# EAGLE design Fascia_physioBoardV0 (EAGLE 9.5.2)
REV: 1
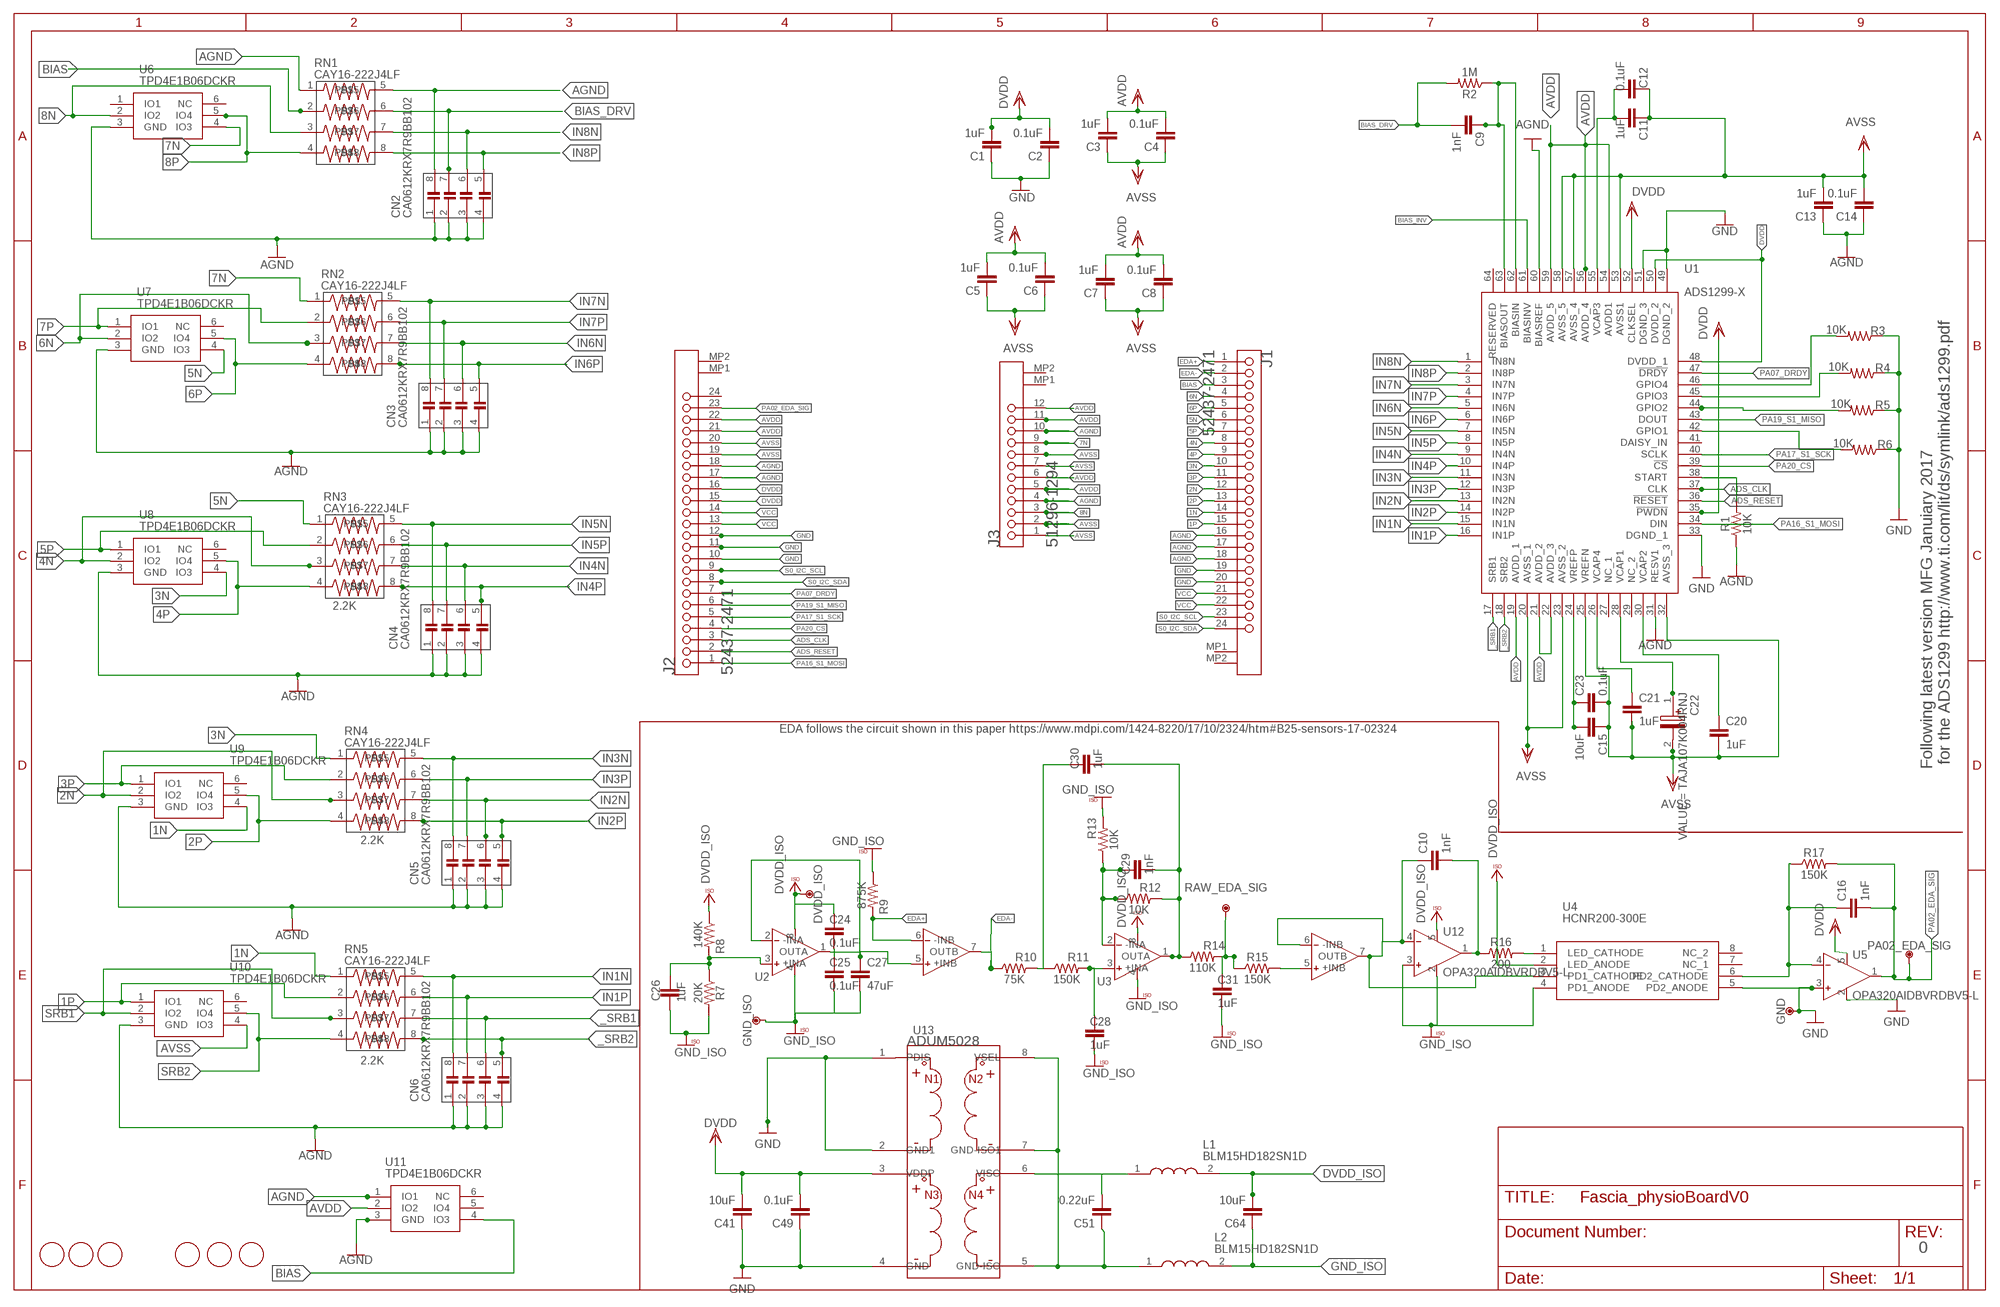
[diagram p0: schematic, sheet 1]
FRAME3 (FRAME_B_L): REV: 0

## Parts
C1  1uF  1UF-0402T-16V-10%  [0402-TIGHT]
C2  0.1uF  0.1UF-0402T-16V-10%  [0402-TIGHT]
C3  1uF  1UF-0402T-16V-10%  [0402-TIGHT]
C4  0.1uF  0.1UF-0402T-16V-10%  [0402-TIGHT]
C5  1uF  1UF-0402T-16V-10%  [0402-TIGHT]
C6  0.1uF  0.1UF-0402T-16V-10%  [0402-TIGHT]
C7  1uF  1UF-0402T-16V-10%  [0402-TIGHT]
C8  0.1uF  0.1UF-0402T-16V-10%  [0402-TIGHT]
C9  1nF  1NF-0402T-16V-10%  [0402-TIGHT]
C10  1nF  1NF-0402T-16V-10%  [0402-TIGHT]
C11  1uF  1UF-0402T-16V-10%  [0402-TIGHT]
C12  0.1uF  0.1UF-0402T-16V-10%  [0402-TIGHT]
C13  1uF  1UF-0402T-16V-10%  [0402-TIGHT]
C14  0.1uF  0.1UF-0402T-16V-10%  [0402-TIGHT]
C15  10uF  0.1UF-0402-16V-10%  [0402]
C16  1nF  1NF-0402T-16V-10%  [0402-TIGHT]
C20  1uF  1UF-0402T-16V-10%  [0402-TIGHT]
C21  1uF  1UF-0402T-16V-10%  [0402-TIGHT]
C22  TAJA107K004RNJ  [CAPPM3216X180N]
C23  0.1uF  0.1UF-0402T-16V-10%  [0402-TIGHT]
C24  0.1uF  0.1UF-0402T-16V-10%  [0402-TIGHT]
C25  0.1uF  0.1UF-0402T-16V-10%  [0402-TIGHT]
C26  1uF  1UF-0402T-16V-10%  [0402-TIGHT]
C27  47uF  47UF-0603-25V-5%  [0603]
C28  1uF  1UF-0402T-16V-10%  [0402-TIGHT]
C29  1nF  1NF-0402T-16V-10%  [0402-TIGHT]
C30  1uF  1UF-0402T-16V-10%  [0402-TIGHT]
C31  1uF  1UF-0402T-16V-10%  [0402-TIGHT]
C41  10uF  10UF-0603-6.3V-20%  [0603]
C49  0.1uF  0.1UF-0402T-16V-10%  [0402-TIGHT]
C51  0.22uF  0.22UF-0402T-16V-10%  [0402-TIGHT]
C64  10uF  10UF-0603-6.3V-20%  [0603]
CN2  CA0612KRX7R9BB102  [CA0612KRX7R9BB102]
CN3  CA0612KRX7R9BB102  [CA0612KRX7R9BB102]
CN4  CA0612KRX7R9BB102  [CA0612KRX7R9BB102]
CN5  CA0612KRX7R9BB102  [CA0612KRX7R9BB102]
CN6  CA0612KRX7R9BB102  [CA0612KRX7R9BB102]
DVDD_ISO  DNP  TPTP-0.8MM  [TP-0.8MM]
FD1  DNP  FIDUCIAL-1.5MM  [FD-1-1.5]
FD2  DNP  FIDUCIAL-1.5MM  [FD-1-1.5]
FD3  DNP  FIDUCIAL-1.5MM  [FD-1-1.5]
FD4  DNP  FIDUCIAL-1.5MM  [FD-1-1.5]
FD5  DNP  FIDUCIAL-1.5MM  [FD-1-1.5]
FD6  DNP  FIDUCIAL-1.5MM  [FD-1-1.5]
GND  DNP  TPTP-0.8MM  [TP-0.8MM]
GND_ISO  DNP  TPTP-0.8MM  [TP-0.8MM]
J1  MOLEX_52437-2471MOLEX_52437-2471_0_0  [MOLEX_52437-2471_0]
J2  MOLEX_52437-2471MOLEX_52437-2471_0_0  [MOLEX_52437-2471_0]
J3  MOLEX_51296-1294MOLEX_51296-1294_0_0  [MOLEX_51296-1294_0]
L1  BLM15HD182SN1D  [INDC1005X55N]
L2  BLM15HD182SN1D  [INDC1005X55N]
PA02_EDA_SIG  DNP  TPTP-0.8MM  [TP-0.8MM]
R1  10K  [0402-TIGHT]
R2  1M  [0402-TIGHT]
R3  10K  [0402-TIGHT]
R4  10K  [0402-TIGHT]
R5  10K  [0402-TIGHT]
R6  10K  [0402-TIGHT]
R7  20K  [0402-TIGHT]
R8  140K  [0402-TIGHT]
R9  875K  [0402-TIGHT]
R10  75K  [0402-TIGHT]
R11  150K  [0402-TIGHT]
R12  10K  [0402-TIGHT]
R13  10K  [0402-TIGHT]
R14  110K  [0402-TIGHT]
R15  150K  [0402-TIGHT]
R16  200  [0402-TIGHT]
R17  150K  [0402-TIGHT]
RAW_EDA_SIG  DNP  TPTP-0.8MM  [TP-0.8MM]
RN1  CAY16-222J4LF  [CAY16-222J4LF]
RN2  CAY16-222J4LF  [CAY16-222J4LF]
RN3  CAY16-222J4LF  [CAY16-222J4LF]
RN4  CAY16-222J4LF  [CAY16-222J4LF]
RN5  CAY16-222J4LF  [CAY16-222J4LF]
U1  ADS1299-X  [QFP50P1200X1200X120-64N]
U2  OPA2320AIDGKT_NOVA8-SOIC-L  [D8-L]
U3  OPA2320AIDGKT_NOVAL8-SOIC-L  [D8-L]
U4  HCNR200-300E  [SOP254P1230X400-8N]
U5  OPA320AIDBVRDBV5-L  [DBV5-L]
U6  TPD4E1B06DCKR  [SOT65P210X110-6N]
U7  TPD4E1B06DCKR  [SOT65P210X110-6N]
U8  TPD4E1B06DCKR  [SOT65P210X110-6N]
U9  TPD4E1B06DCKR  [SOT65P210X110-6N]
U10  TPD4E1B06DCKR  [SOT65P210X110-6N]
U11  TPD4E1B06DCKR  [SOT65P210X110-6N]
U12  OPA320AIDBVRDBV5-L  [DBV5-L]
U13  ADUM5028  [SOIC_IC]

## Nets
1N: J1.14 RN5.1 U9.4(IO3)
1P: J1.15 RN5.2 U10.1(IO1)
2N: J1.12 RN4.3 U9.2(IO2)
2P: J1.13 RN4.4 U9.5(IO4)
3N: J1.10 RN4.1 U8.4(IO3)
3P: J1.11 RN4.2 U9.1(IO1)
4N: J1.8 RN3.3 U8.2(IO2)
4P: J1.9 RN3.4 U8.5(IO4)
5N: J1.6 RN3.1 U7.4(IO3)
5P: J1.7 RN3.2 U8.1(IO1)
6N: J1.4 RN2.3 U7.2(IO2)
6P: J1.5 RN2.4 U7.5(IO4)
7N: J3.9 RN2.1 U6.4(IO3)
7P: RN2.2 U7.1(IO1)
8N: J3.3 RN1.3 U6.2(IO2)
8P: RN1.4 U6.5(IO4)
_SRB1: CN6.6(C15) RN5.7 U1.17(SRB1)
_SRB2: CN6.5(C14) RN5.8 U1.18(SRB2)
ADS_CLK: J2.3 U1.37(CLK)
ADS_RESET: J2.2 U1.36(!RESET)
AGND: C13.1 C14.1 CN2.1(C10) CN2.2(C11) CN2.3(C12) CN2.4(C13) CN2.8(C17) CN3.1(C10) CN3.2(C11) CN3.3(C12) CN3.4(C13) CN4.1(C10) CN4.2(C11) CN4.3(C12) CN4.4(C13) CN5.1(C10) CN5.2(C11) CN5.3(C12) CN5.4(C13) CN6.1(C10) CN6.2(C11) CN6.3(C12) CN6.4(C13) J1.16 J1.17 J1.18 J2.17 J2.18 J3.4 J3.10 R1.1 RN1.1 RN1.5 U1.31(RESV1) U1.60(BIASREF) U6.3(GND) U7.3(GND) U8.3(GND) U9.3(GND) U10.3(GND) U11.1(IO1) U11.3(GND)
AVDD: C3.2 C4.2 C5.2 C6.2 C7.2 C8.2 J2.21 J2.22 J3.5 J3.6 J3.11 J3.12 U1.19(AVDD_1) U1.21(AVDD_2) U1.22(AVDD_3) U1.54(AVDD1) U1.56(AVDD_4) U1.59(AVDD_5) U11.2(IO2)
AVSS: C3.1 C4.1 C5.1 C6.1 C7.1 C8.1 C11.1 C12.1 C13.2 C14.2 C15.1 C20.2 C21.2 C22.2(-) C23.2 J2.19 J2.20 J3.1 J3.2 J3.7 J3.8 U1.20(AVSS_1) U1.23(AVSS_2) U1.25(VREFN) U1.32(AVSS_3) U1.53(AVSS1) U1.57(AVSS_4) U1.58(AVSS_5) U10.4(IO3)
BIAS: J1.3 RN1.2 U11.4(IO3)
BIAS_DRV: C9.2 CN2.7(C16) R2.2 RN1.6
BIAS_INV: U1.61(BIASINV)
DVDD: C1.2 C2.2 C41.2 C49.2 J2.15 J2.16 U1.35(!PWDN) U1.48(DVDD_1) U1.50(DVDD_2) U1.52(CLKSEL) U5.5(V+) U13.3(VDDP)
DVDD_ISO: C24.1 C64.2 DVDD_ISO.X L1.2 R8.1 U2.8(V+) U3.8(V+) U4.2(LED_ANODE) U12.5(V+)
EDA+: J1.1 R9.2 U2.6(-INB)
EDA-: J1.2 R10.1 U2.7(OUTB)
GND: C1.1 C2.1 C41.1 C49.1 GND.X J1.19 J1.20 J2.10 J2.11 J2.12 R3.1 R4.1 R5.1 R6.1 U1.33(DGND_1) U1.49(DGND_2) U1.51(DGND_3) U4.5(PD2_ANODE) U5.2(V-) U5.3(IN+) U13.1(PDIS) U13.2(GND1) U13.4(GND)
GND_ISO: C25.2 C26.2 C27.2 C28.2 C31.2 C51.1 C64.1 GND_ISO.X L2.1 L2.2 R7.2 R9.1 R13.2 U2.4(V-) U3.4(V-) U4.4(PD1_ANODE) U12.2(V-) U12.3(IN+) U13.5(GND-ISO) U13.7(GND-ISO1) U13.8(VSEL)
IN1N: CN6.8(C17) RN5.5 U1.15(IN1N)
IN1P: CN6.7(C16) RN5.6 U1.16(IN1P)
IN2N: CN5.6(C15) RN4.7 U1.13(IN2N)
IN2P: CN5.5(C14) RN4.8 U1.14(IN2P)
IN3N: CN5.8(C17) RN4.5 U1.11(IN3N)
IN3P: CN5.7(C16) RN4.6 U1.12(IN3P)
IN4N: CN4.6(C15) RN3.7 U1.9(IN4N)
IN4P: CN4.5(C14) RN3.8 U1.10(IN4P)
IN5N: CN4.8(C17) RN3.5 U1.7(IN5N)
IN5P: CN4.7(C16) RN3.6 U1.8(IN5P)
IN6N: CN3.6(C15) RN2.7 U1.5(IN6N)
IN6P: CN3.5(C14) RN2.8 U1.6(IN6P)
IN7N: CN3.8(C17) RN2.5 U1.3(IN7N)
IN7P: CN3.7(C16) RN2.6 U1.4(IN7P)
IN8N: CN2.6(C15) RN1.7 U1.1(IN8N)
IN8P: CN2.5(C14) RN1.8 U1.2(IN8P)
N$1: C30.1 R10.2 R11.1
N$2: C26.1 R7.1 R8.2 U2.3(+INA)
N$3: C28.1 R11.2 U3.3(+INA)
N$4: C31.1 R14.2 R15.1 RAW_EDA_SIG.X
N$5: C10.2 R16.1 U12.1(OUT)
N$6: C51.2 L1.1 U13.6(VISO)
N$7: R16.2 U4.1(LED_CATHODE)
N$9: C16.1 R17.1 U4.6(PD2_CATHODE) U5.4(IN-)
N$10: C29.1 R12.1 R13.1 U3.2(-INA)
N$11: C29.2 C30.2 R12.2 R14.1 U3.1(OUTA)
N$12: C24.2 C25.1 C27.1 U2.2(-INA) U2.5(+INB)
N$14: R15.2 U3.5(+INB)
N$15: C10.1 U3.6(-INB) U3.7(OUTB) U4.3(PD1_CATHODE) U12.4(IN-)
N$17: C9.1 R2.1 U1.62(BIASIN) U1.63(BIASOUT)
N$22: C15.2 C23.1 U1.24(VREFP)
N$24: R3.2 U1.46(GPIO4)
N$48: R4.2 U1.45(GPIO3)
N$50: R5.2 U1.44(GPIO2)
N$52: R6.2 U1.42(GPIO1)
N$59: C21.1 U1.26(VCAP4)
N$60: C22.1(+) U1.28(VCAP1)
N$61: C20.1 U1.30(VCAP2)
N$63: C11.2 C12.2 U1.55(VCAP3)
N$66: R1.2 U1.38(START)
PA02_EDA_SIG: C16.2 J2.23 PA02_EDA_SIG.X R17.2 U5.1(OUT)
PA07_DRDY: J2.7 U1.47(!DRDY)
PA16_S1_MOSI: J2.1 U1.34(DIN)
PA17_S1_SCK: J2.5 U1.40(SCLK)
PA19_S1_MISO: J2.6 U1.43(DOUT)
PA20_CS: J2.4 U1.39(!CS)
S0_I2C_SCL: J1.23 J2.9
S0_I2C_SDA: J1.24 J2.8
SRB1: RN5.3 U10.2(IO2)
SRB2: RN5.4 U10.5(IO4)
VCC: J1.21 J1.22 J2.13 J2.14
Unconnected: J1.MP1 J1.MP2 J2.24 J2.MP1 J2.MP2 J3.MP1 J3.MP2 U1.27(NC_1) U1.29(NC_2) U1.41(DAISY_IN) U1.64(RESERVED) U2.1(OUTA) U4.7(NC_1) U4.8(NC_2) U6.1(IO1) U6.6(NC) U7.6(NC) U8.6(NC) U9.6(NC) U10.6(NC) U11.5(IO4) U11.6(NC)

## Notes on the sheet
- 2.2K
- EDA follows the circuit shown in this paper https://www.mdpi.com/1424-8220/17/10/2324/htm#B25-sensors-17-02324
- Following latest version MFG Januiary 2017
   for the ADS1299 http://www.ti.com/lit/ds/symlink/ads1299.pdf
- 2.2K
- ADUM5028
- 2.2K

## Library data of the parts
C1 C3 C5 C7 C11 C13 C20 C21 C26 C28 C30 C31 = novaXR:1UF: 1µF ceramic capacitors A capacitor is a passive two-terminal electrical component used to store electrical energy temporarily in an electric field.; PROD_ID: CAP-12416
C2 C4 C6 C8 C12 C14 C23-C25 C49 = novaXR:0.1UF: 0.1µF ceramic capacitors A capacitor is a passive two-terminal electrical component used to store electrical energy temporarily in an electric field.; PROD_ID: CAP-12416
C9 C10 C16 C29 = novaXR:1NF: 1nF ceramic capacitors A capacitor is a passive two-terminal electrical component used to store electrical energy temporarily in an electric field.; PROD_ID: CAP-12416
C15 = SparkFun-Capacitors:0.1UF: 0.1µF ceramic capacitors A capacitor is a passive two-terminal electrical component used to store electrical energy temporarily in an electric field.; PROD_ID: CAP-12416; VALUE: 0.1uF
C22 = SamacSys_Parts:TAJA107K004RNJ: AVX 100uF 4 V dc Tantalum Capacitor Electrolytic Solid +/-10% Tolerance TAJ Series Source: Datasheet; DESCRIPTION: AVX 100uF 4 V dc Tantalum Capacitor Electrolytic Solid +/-10% Tolerance TAJ Series; HEIGHT: 1.8mm; MANUFACTURER_NAME: AVX; MANUFACTURER_PART_NUMBER: TAJA107K004RNJ; MOUSER_PART_NUMBER: 581-TAJA107K004RNJ; MOUSER_PRICE-STOCK: https://www.mouser.com/Search/Refine.aspx?Keyword=581-TAJA107K004RNJ; RS_PART_NUMBER: 1360130; RS_PRICE-STOCK: http://uk.rs-online.com/web/p/products/1360130
C27 = novaXR:47UF: 47µF ceramic capacitors A capacitor is a passive two-terminal electrical component used to store electrical energy temporarily in an electric field.; PROD_ID: CAP-08604
C41 C64 = SparkFun-Capacitors:10UF: 10.0µF ceramic capacitors A capacitor is a passive two-terminal electrical component used to store electrical energy temporarily in an electric field.; PROD_ID: CAP-11015
C51 = novaXR:0.22UF: 0,22uF ceramic capacitors A capacitor is a passive two-terminal electrical component used to store electrical energy temporarily in an electric field.; PROD_ID: CAP-12416
CN2-CN6 = SamacSys_Parts:CA0612KRX7R9BB102: Capacitor,ceramic,multilayer,SMT,50V,1000pF Source: Datasheet; DESCRIPTION: Capacitor,ceramic,multilayer,SMT,50V,1pF; HEIGHT: mm; MANUFACTURER_NAME: YAGEO (PHYCOMP); MANUFACTURER_PART_NUMBER: CA0612KRX7R9BB102; MOUSER_PART_NUMBER: 603-CA612KRX7R9BB102; MOUSER_PRICE-STOCK: https://www.mouser.com/Search/Refine.aspx?Keyword=603-CA612KRX7R9BB102; RS_PART_NUMBER: 6169789; RS_PRICE-STOCK: http://uk.rs-online.com/web/p/products/6169789
DVDD_ISO GND GND_ISO PA02_EDA_SIG RAW_EDA_SIG = Arduino-utility:TP: Testpoint; CODE-ARDUINO: DNP; DATASHEET: DNP; DISTRIBUTOR-LINK: DNP; DISTRIBUTOR-PN: DNP; MANUFACTURER: DNP; MANUFACTURER-PN: DNP
FD1-FD6 = Arduino-utility:FIDUCIAL: Fiducial mount; CODE-ARDUINO: DNP; DATASHEET: DNP; DISTRIBUTOR-LINK: DNP; DISTRIBUTOR-PN: DNP; MANUFACTURER: DNP; MANUFACTURER-PN: DNP
J1 J2 = Molex - 52437-2471:MOLEX_52437-2471: MOLX-52437-2471; CIIVA_IDS: 605212; CIRCUITS_LOADED: 24; COMPONENT_LINK_1_DESCRIPTION: Manufacturer URL; COMPONENT_LINK_1_URL: http://www.molex.com/molex/index.jsp; COMPONENT_LINK_3_DESCRIPTION: Package Specification; COMPONENT_LINK_3_URL: http://www.molex.com/pdm_docs/sd/524372471_sd.pdf; CONTACT_POSITION: Bottom; CURRENT_MAX_PER_CONTACT: 0.5A; DATASHEET: http://www.molex.com/webdocs/datasheets/pdf/en-us/0524372471_FFC_FPC_CONNECTORS.pdf; DURABILITY_MATING_CYCLES_MAX: 20; ENTRY_ANGLE: 90degrees Angle; FOOTPRINT_VARIANT_NAME_0: Manufacturer Recommended; IMPORTED: yes; IMPORTED_FROM: vault; IMPORT_TS: 1521869192; MATERIAL___METAL: Phosphor Bronze; MATERIAL___PLATING_MATING: Gold; MATERIAL___PLATING_TERMINATION: Gold; MF: Molex; MOUNTING_TECHNOLOGY: Surface Mount; MPN: 52437-2471; NUMBER_OF_ROWS: 1; ORIENTATION: Right Angle; PACKAGE: 52437-2471; PACKAGE_DESCRIPTION: 24-Lead FPC Connector, Pitch 0.5 mm; PACKAGE_VERSION: Rev. E, 07/2013; PACKING: Tape and Reel; PCB_LOCATOR: No; PCB_RETENTION: None; PITCH___MATING_INTERFACE: 0.50mm; POLARIZED_TO_PCB: Yes; PREFIX: J; RELEASE_DATE: 1411372502; ROHS: Yes; STACKABLE: No; VAULT_GUID: C435F480-C5D6-47A9-8B3E-1F527B5FE02A; VAULT_REVISION: D1E34D73-9D44-46B4-956C-D39459EFC8BE; VOLTAGE_MAX: 50V
J3 = Molex - 51296-1294:MOLEX_51296-1294: MOLX-51296-1294; CIIVA_IDS: 3408585; CIRCUITS_LOADED: 12; COMPONENT_LINK_1_DESCRIPTION: Manufacturer URL; COMPONENT_LINK_1_URL: http://www.molex.com/molex/index.jsp; COMPONENT_LINK_3_DESCRIPTION: Package Specification; COMPONENT_LINK_3_URL: http://www.molex.com/pdm_docs/sd/512961294_sd.pdf; CONTACT_POSITION: Bottom; CURRENT_MAX_PER_CONTACT: 0.5A; DATASHEET: http://www.molex.com/webdocs/datasheets/pdf/en-us/0512961294_FFC_FPC_CONNECTORS.pdf; DURABILITY_MATING_CYCLES_MAX: 20; ENTRY_ANGLE: 90degrees Angle; FOOTPRINT_VARIANT_NAME_0: Manufacturer Recommended; IMPORTED: yes; IMPORTED_FROM: vault; IMPORT_TS: 1521848761; MATED_HEIGHT: 1.30mm; MATERIAL___METAL: Phosphor Bronze; MATERIAL___PLATING_MATING: Gold; MATERIAL___PLATING_TERMINATION: Gold; MF: Molex; MOUNTING_TECHNOLOGY: Surface Mount; MPN: 51296-1294; NUMBER_OF_ROWS: 1; ORIENTATION: Right Angle; PACKAGE: 51296-1294; PACKAGE_DESCRIPTION: 12-Lead FPC Connector, Pitch 0.5 mm; PACKAGE_VERSION: Rev. G, 02/2011; PACKING: Tape and Reel; PCB_LOCATOR: No; PCB_RETENTION: Yes; PITCH___MATING_INTERFACE: 0.50mm; POLARIZED_TO_PCB: Yes; PREFIX: J; RELEASE_DATE: 1411372363; ROHS: Yes; STACKABLE: No; VAULT_GUID: 5BB98A37-1DFE-42F8-ACC0-A2F2CBD76221; VAULT_REVISION: D4EEA741-95BA-4F80-9A9C-18942DF65E75; VOLTAGE_MAX: 50V AC (RMS)/DC
L1 L2 = SamacSys_Parts:BLM15HD182SN1D: Ferrite bead SMD 0402 1K8 200mA Ferrite bead SMD 0402 1K8 200mA Source: Datasheet; DESCRIPTION: Ferrite bead SMD 0402 1K8 200mA Ferrite bead SMD 0402 1K8 200mA; HEIGHT: 0.55mm; MANUFACTURER_NAME: Murata Electronics; MANUFACTURER_PART_NUMBER: BLM15HD182SN1D; MOUSER_PART_NUMBER: 81-BLM15HD182SN1D; MOUSER_PRICE-STOCK: https://www.mouser.com/Search/Refine.aspx?Keyword=81-BLM15HD182SN1D; RS_PART_NUMBER: 7926224P; RS_PRICE-STOCK: http://uk.rs-online.com/web/p/products/7926224P
R1 R3-R6 R12 R13 = novaXR:10K: 10KΩ resistor A resistor is a passive two-terminal electrical component that implements electrical resistance as a circuit element. Resistors act to reduce current flow, and, at the same time, act to lower voltage levels within circuits. - Wikipedia
R2 = novaXR:1M: 1MΩ resistor A resistor is a passive two-terminal electrical component that implements electrical resistance as a circuit element. Resistors act to reduce current flow, and, at the same time, act to lower voltage levels within circuits. - Wikipedia
R7 = novaXR:20K: 20KΩ resistor A resistor is a passive two-terminal electrical component that implements electrical resistance as a circuit element. Resistors act to reduce current flow, and, at the same time, act to lower voltage levels within circuits. - Wikipedia
R8 = novaXR:140K: 140KΩ resistor A resistor is a passive two-terminal electrical component that implements electrical resistance as a circuit element. Resistors act to reduce current flow, and, at the same time, act to lower voltage levels within circuits. - Wikipedia
R9 = novaXR:875K: 875KΩ resistor A resistor is a passive two-terminal electrical component that implements electrical resistance as a circuit element. Resistors act to reduce current flow, and, at the same time, act to lower voltage levels within circuits. - Wikipedia
R10 = novaXR:75K: 75KΩ resistor A resistor is a passive two-terminal electrical component that implements electrical resistance as a circuit element. Resistors act to reduce current flow, and, at the same time, act to lower voltage levels within circuits. - Wikipedia
R11 R15 R17 = novaXR:150K: 150KΩ resistor A resistor is a passive two-terminal electrical component that implements electrical resistance as a circuit element. Resistors act to reduce current flow, and, at the same time, act to lower voltage levels within circuits. - Wikipedia
R14 = novaXR:110K: 110KΩ resistor A resistor is a passive two-terminal electrical component that implements electrical resistance as a circuit element. Resistors act to reduce current flow, and, at the same time, act to lower voltage levels within circuits. - Wikipedia
R16 = novaXR:200: 200Ω resistor A resistor is a passive two-terminal electrical component that implements electrical resistance as a circuit element. Resistors act to reduce current flow, and, at the same time, act to lower voltage levels within circuits. - Wikipedia
RN1-RN5 = SamacSys_Parts:CAY16-222J4LF: 2.2k Ohm ±5% 62.5mW Power Per Element Isolated 4 Resistor Network/Array ±200ppm/°C 1206 (3216 Metric), Convex, Long Side Terminals Source: Datasheet; DESCRIPTION: RES ARRAY 4 RES 2.2K OHM 1206; DIGIKEY_NUMBER: CAY16-222J4LFCT-ND; HEIGHT: 0mm; MANUFACTURER_NAME: Bourns Inc; MANUFACTURER_PART_NUMBER: CAY16-222J4LF
U1 = SamacSys_Parts:ADS1299-X: ADS1299-x 24-Bit Analog-to-Digital Converters (ADCs) Source: Datasheet; DESCRIPTION: ADS1299-x 24-Bit Analog-to-Digital Converters (ADCs); HEIGHT: 1.2mm; MANUFACTURER_NAME: Texas Instruments; MANUFACTURER_PART_NUMBER: ADS1299-X
U2 = novaXR:OPA2320AIDGKT_NOVA: OPA2320AIDGKT, Dual Operational Amplifier Precision, 20MHz R-R, 1.8 to 5.5V, 8-Pin MSOP Source: Datasheet
U3 = novaXR:OPA2320AIDGKT_NOVAL: OPA2320AIDGKT, Dual Operational Amplifier Precision, 20MHz R-R, 1.8 to 5.5V, 8-Pin MSOP Source: Datasheet
U4 = HCNR200-300E:HCNR200-300E: Optocoupler AC/DC i/p DC o/p PDIP8 W SMD Avago HCNR200-300E DC Input Photodiode Output Optocoupler, Surface Mount, 8-Pin PDIP-W Source: Datasheet; DESCRIPTION: Optocoupler AC/DC i/p DC o/p PDIP8 W SMD Avago HCNR200-300E DC Input Photodiode Output Optocoupler, Surface Mount, 8-Pin PDIP-W; HEIGHT: 4mm; MANUFACTURER_NAME: Avago Technologies; MANUFACTURER_PART_NUMBER: HCNR200-300E; MOUSER_PART_NUMBER: 630-HCNR200-300E; MOUSER_PRICE-STOCK: https://www.mouser.com/Search/Refine.aspx?Keyword=630-HCNR200-300E; RS_PART_NUMBER: 6935264P; RS_PRICE-STOCK: http://uk.rs-online.com/web/p/products/6935264P
U5 U12 = novaXR:OPA320AIDBVR; MANUFACTURER_PART_NUMBER: OPA320AIDBVR; VENDOR: Texas Instruments
U6-U11 = SamacSys_Parts:TPD4E1B06DCKR: Texas Instruments TPD4E1B06DCKR Quad Bi-Directional ESD Protection Array, 45W peak, 6-Pin SC-70 Source: Datasheet; DESCRIPTION: Texas Instruments TPD4E1B06DCKR Quad Bi-Directional ESD Protection Array, 45W peak, 6-Pin SC-70; HEIGHT: 1.1mm; MANUFACTURER_NAME: Texas Instruments; MANUFACTURER_PART_NUMBER: TPD4E1B06DCKR; MOUSER_PART_NUMBER: 595-TPD4E1B06DCKR; MOUSER_PRICE-STOCK: https://www.mouser.com/Search/Refine.aspx?Keyword=595-TPD4E1B06DCKR; RS_PART_NUMBER: 8255330P; RS_PRICE-STOCK: http://uk.rs-online.com/web/p/products/8255330P
U13 = novaXR:ADUM5028: The ADuM5020 and ADuM50281 are isoPower®, integrated, isolated dc-to-dc converters. Based on the Analog Devices, Inc., iCoupler® technology, these dc-to-dc converters provide regulated, isolated power that is below CISPR22 Class B limits at full load on a 2-layer printed circuit board (PCB) with ferrites

## Net classes
0 default: width 0.19 mm, drill 0.19 mm

## Board
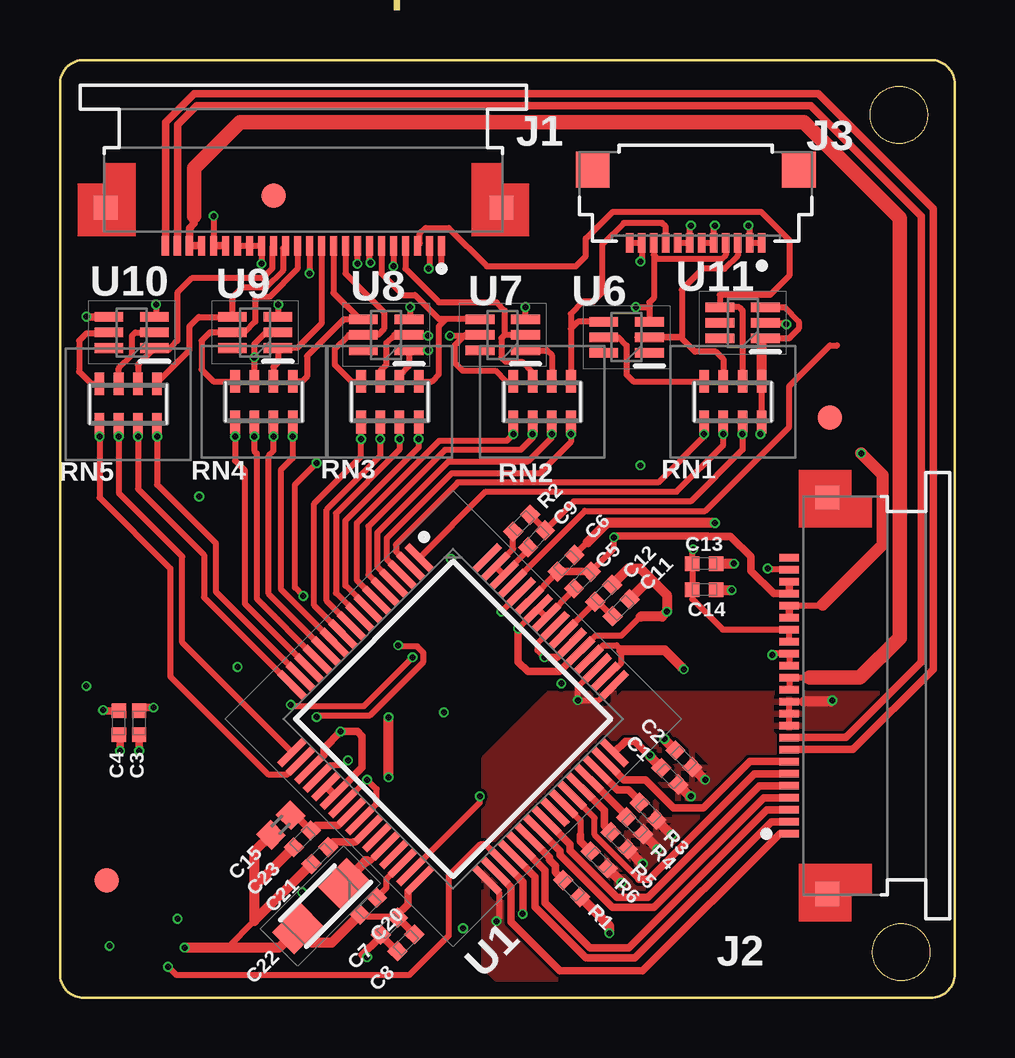
[diagram p1: board, top side]
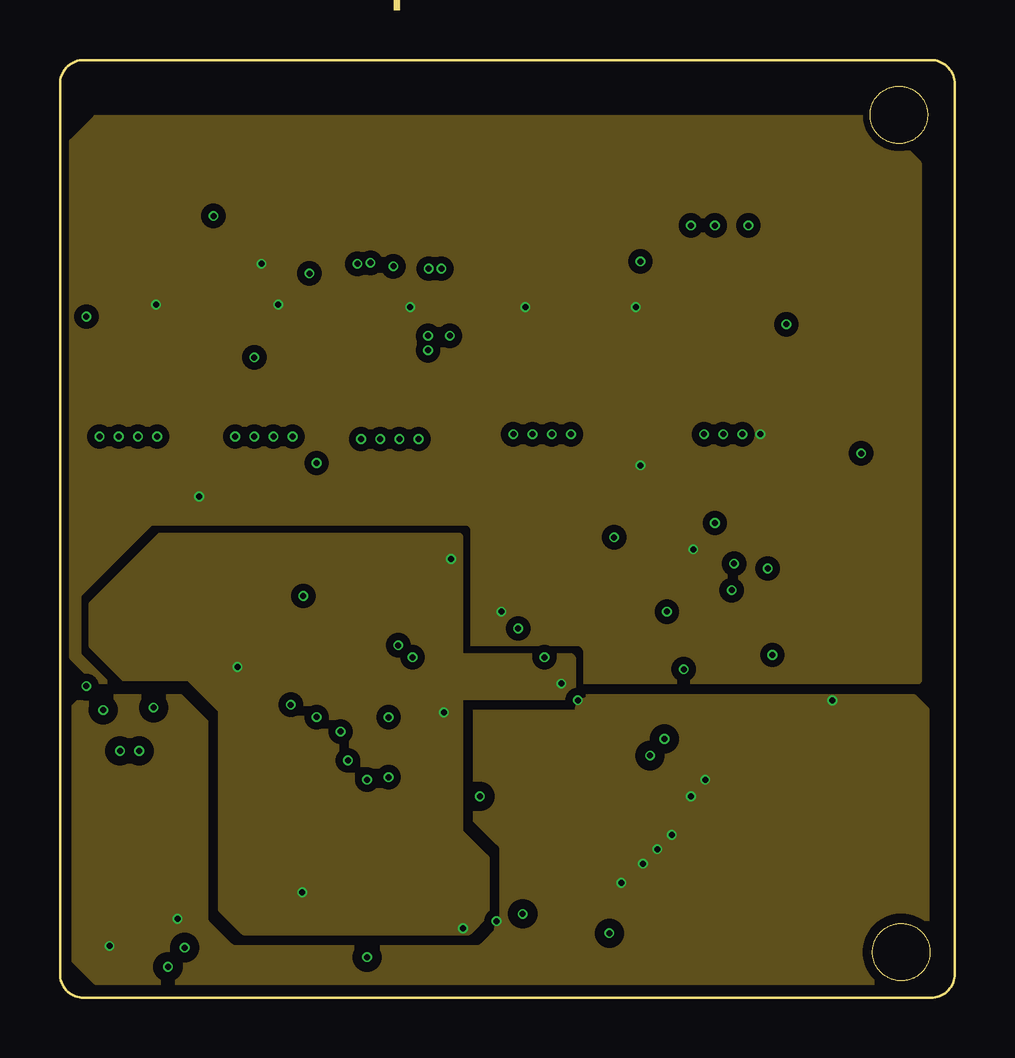
[diagram p2: board, inner layer Route2]
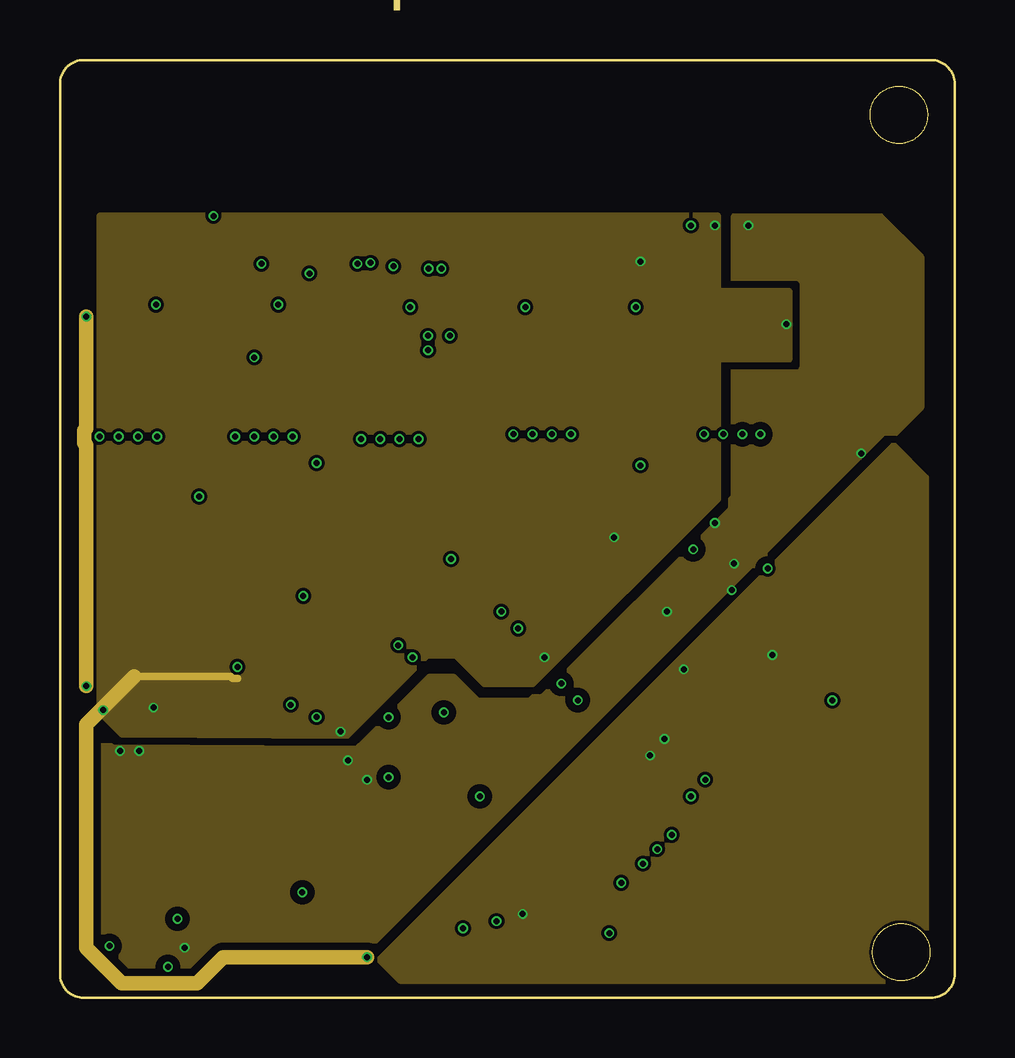
[diagram p3: board, inner layer Route15]
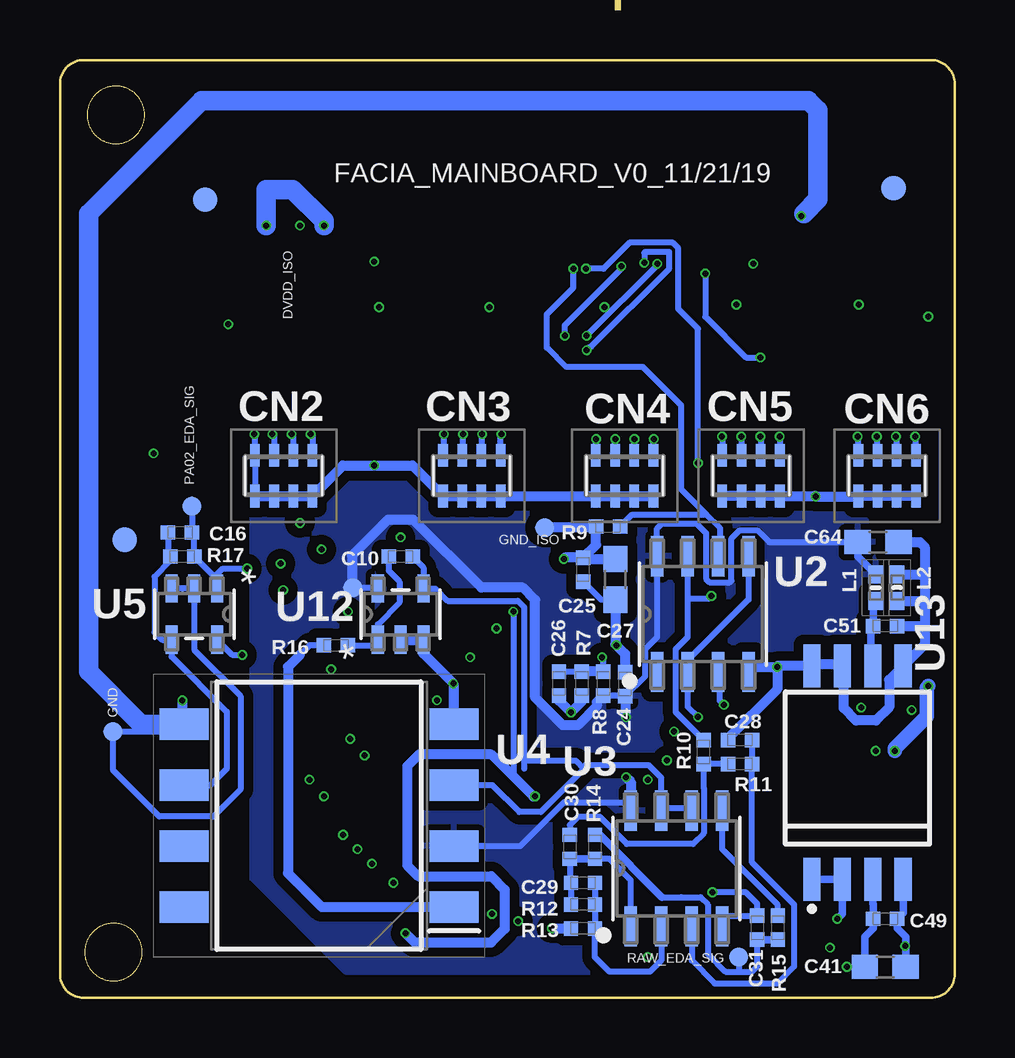
[diagram p4: board, bottom side, seen from below]

Size 37.3 x 39.1 mm. Coordinates in mm from the lower left corner, seen from the top.
Outline: 370 segments
Copper layers ([15:(1*2)+15*16]): Top 0.035mm / dielectric 0.213359375mm / Route2 0.035mm / dielectric 1.0161mm / Route15 0.035mm / dielectric 0.213359375mm / Bottom 0.035mm
Design rules "SparkFun-4-layer-PCBWAY-LIMIT *": minimum track width 0.25mm, minimum drill 0.2mm, track to track 5mil, track to pad 5mil, pad to pad 5mil, via to via 5mil, smd to smd 0mil, copper to edge 5mil, drill to drill 5mil, minimum pad ring 3mil, minimum via ring 3mil, stop-mask expansion 4mil, vias tented up to drill 25mil, thermal gap 10mil

### Footprints (pad centres in the part's own frame; a part is rotated, then mirrored left to right if it is on the bottom)
0402-TIGHT = smd 0.6 x 0.6: 1 -0.5,0; 2 0.5,0
0402 = smd 0.85 x 0.9: 1 -0.58,0; 2 0.58,0
CAPPM3216X180N = smd 1.7 x 1.3: 1 -1.35,0; 2 1.35,0
0603 = smd 1.1 x 1: 1 -0.85,0; 2 0.85,0
CA0612KRX7R9BB102 = smd 0.95 x 0.4: 1 -0.85,1.2; 2 -0.85,0.4; 3 -0.85,-0.4; 4 -0.85,-1.2; 5 0.85,-1.2; 6 0.85,-0.4; 7 0.85,0.4; 8 0.85,1.2
TP-0.8MM = smd 0.8 x 0.8 bottom: X 0,0
FD-1-1.5 = smd 1.016 x 1.016: P$1 0,0
MOLEX_52437-2471_0 = smd 0.3 x 0.8: 1 -5.75,0.8; 2 -5.25,0.8; 3 -4.75,0.8; 4 -4.25,0.8; 5 -3.75,0.8; 6 -3.25,0.8; 7 -2.75,0.8; 8 -2.25,0.8; 9 -1.75,0.8; 10 -1.25,0.8; 11 -0.75,0.8; 12 -0.25,0.8; 13 0.25,0.8; 14 0.75,0.8; 15 1.25,0.8; 16 1.75,0.8; 17 2.25,0.8; 18 2.75,0.8; 19 3.25,0.8; 20 3.75,0.8; 21 4.25,0.8; 22 4.75,0.8; 23 5.25,0.8; 24 5.75,0.8 | smd 1 x 1: MP1 -8.25,-0.8; MP2 8.25,-0.8
MOLEX_51296-1294_0 = smd 0.3 x 0.8: 1 -2.75,1.525; 2 -2.25,1.525; 3 -1.75,1.525; 4 -1.25,1.525; 5 -0.75,1.525; 6 -0.25,1.525; 7 0.25,1.525; 8 0.75,1.525; 9 1.25,1.525; 10 1.75,1.525; 11 2.25,1.525; 12 2.75,1.525 | smd 1.4 x 1.5: MP1 -4.3,-1.525; MP2 4.3,-1.525
INDC1005X55N = smd 0.75 x 0.6: 1 -0.55,0; 2 0.55,0
CAY16-222J4LF = smd 0.95 x 0.4: 1 -0.85,1.2; 2 -0.85,0.4; 3 -0.85,-0.4; 4 -0.85,-1.2; 5 0.85,1.2; 6 0.85,0.4; 7 0.85,-0.4; 8 0.85,-1.2
QFP50P1200X1200X120-64N = smd 1.475 x 0.3: 1 -5.738,3.75; 2 -5.738,3.25; 3 -5.738,2.75; 4 -5.738,2.25; 5 -5.738,1.75; 6 -5.738,1.25; 7 -5.738,0.75; 8 -5.738,0.25; 9 -5.738,-0.25; 10 -5.738,-0.75; 11 -5.738,-1.25; 12 -5.738,-1.75; 13 -5.738,-2.25; 14 -5.738,-2.75; 15 -5.738,-3.25; 16 -5.738,-3.75; 33 5.738,-3.75; 34 5.738,-3.25; 35 5.738,-2.75; 36 5.738,-2.25; 37 5.738,-1.75; 38 5.738,-1.25; 39 5.738,-0.75; 40 5.738,-0.25; 41 5.738,0.25; 42 5.738,0.75; 43 5.738,1.25; 44 5.738,1.75; 45 5.738,2.25; 46 5.738,2.75; 47 5.738,3.25; 48 5.738,3.75 | smd 0.3 x 1.475: 17 -3.75,-5.738; 18 -3.25,-5.738; 19 -2.75,-5.738; 20 -2.25,-5.738; 21 -1.75,-5.738; 22 -1.25,-5.738; 23 -0.75,-5.738; 24 -0.25,-5.738; 25 0.25,-5.738; 26 0.75,-5.738; 27 1.25,-5.738; 28 1.75,-5.738; 29 2.25,-5.738; 30 2.75,-5.738; 31 3.25,-5.738; 32 3.75,-5.738; 49 3.75,5.738; 50 3.25,5.738; 51 2.75,5.738; 52 2.25,5.738; 53 1.75,5.738; 54 1.25,5.738; 55 0.75,5.738; 56 0.25,5.738; 57 -0.25,5.738; 58 -0.75,5.738; 59 -1.25,5.738; 60 -1.75,5.738; 61 -2.25,5.738; 62 -2.75,5.738; 63 -3.25,5.738; 64 -3.75,5.738
D8-L = smd 1.676 x 0.508: 1 -2.413,1.905; 2 -2.413,0.635; 3 -2.413,-0.635; 4 -2.413,-1.905; 5 2.413,-1.905; 6 2.413,-0.635; 7 2.413,0.635; 8 2.413,1.905
SOP254P1230X400-8N = smd 2.05 x 1.3: 1 -5.625,3.81; 2 -5.625,1.27; 3 -5.625,-1.27; 4 -5.625,-3.81; 5 5.625,-3.81; 6 5.625,-1.27; 7 5.625,1.27; 8 5.625,3.81
DBV5-L = smd 1.168 x 0.508: 1 -1.067,0.95; 2 -1.067,0; 3 -1.067,-0.95; 4 1.067,-0.95; 5 1.067,0.95
SOT65P210X110-6N = smd 1.2 x 0.4: 1 -0.95,0.65; 2 -0.95,0; 3 -0.95,-0.65; 4 0.95,-0.65; 5 0.95,0; 6 0.95,0.65
SOIC_IC = smd 0.72 x 1.78: 1 -2.159,-2.858; 2 -0.889,-2.858; 3 0.381,-2.858; 4 1.651,-2.858; 5 1.651,6.042; 6 0.381,6.042; 7 -0.889,6.042; 8 -2.159,6.042

### Placement (x,y rotation side)
C1  25.42,9.24 135 top
C2  26.01,9.97 135 top
C3  2.45,11.47 90 top
C4  3.3,11.47 90 top
C5  21.78,17.42 45 top
C6  21.1,18.12 225 top
C7  13.72,2.99 225 top
C8  14.42,2.3 225 top
C9  19.86,19.14 45 top
C10  23.1,18.4 180 bottom
C11  23.39,16.26 225 top
C12  22.66,16.87 225 top
C13  26.86,18.1 0 top
C14  26.86,17.02 0 top
C15  9.21,7.21 45 top
C16  32.3,19.4 0 bottom
C20  12.85,3.83 225 top
C21  10.83,5.94 225 top
C22  10.86,3.83 225 top
C23  10.1,6.63 225 top
C24  13.74,13.08 90 bottom
C25  15.49,17.85 90 bottom
C26  16.5,13.1 270 bottom
C27  14.15,17.45 90 bottom
C28  8.95,10.75 180 bottom
C29  15.5,4.8 180 bottom
C30  16.05,6.3 270 bottom
C31  8.23,2.93 90 bottom
C41  2.9,1.3 180 bottom
C49  2.9,3.3 180 bottom
C51  2.9,15.5 180 bottom
C64  3.2,19 180 bottom
CN2  27.97,21.77 90 bottom
CN3  20.13,21.77 90 bottom
CN4  13.76,21.77 90 bottom
CN5  8.49,21.77 90 bottom
CN6  2.82,21.77 90 bottom
DVDD_ISO  25.1,17.1 270 top
FD1  31.25,33.27 180 bottom
FD2  32.1,24.2 270 top
FD3  34.6,19.1 90 bottom
FD4  8.9,33.45 270 top
FD5  2.55,33.75 180 bottom
FD6  1.95,4.9 270 top
GND  35.1,11.1 270 top
GND_ISO  17.1,19.6 270 top
J1  10.15,32.15 180 top
J2  31.2,12.6 90 top
J3  26.5,33 180 top
L1  3.3,17.1 90 bottom
L2  2.4,17.1 270 bottom
PA02_EDA_SIG  31.8,20.5 270 top
R1  21.33,4.56 135 top
R2  19.24,19.79 45 top
R3  24.51,7.78 135 top
R4  23.96,7.18 135 top
R5  23.32,6.55 135 top
R6  22.48,5.75 135 top
R7  15.55,13.1 270 bottom
R8  14.65,13.1 90 bottom
R9  14.45,19.65 0 bottom
R10  10.47,10.25 270 bottom
R11  8.95,9.75 0 bottom
R12  15.5,3.9 180 bottom
R13  15.5,2.9 180 bottom
R14  15,6.3 90 bottom
R15  7.37,2.93 90 bottom
R16  25.8,14.7 180 bottom
R17  32.2,18.4 0 bottom
RAW_EDA_SIG  9,1.7 270 top
RN1  28.05,24.85 270 top
RN2  20.1,24.85 270 top
RN3  13.75,24.85 270 top
RN4  8.5,24.85 270 top
RN5  2.85,24.75 270 top
U1  16.39,11.63 315 top
U2  10.5,16 90 bottom
U3  11.6,5.4 90 bottom
U4  26.5,7.6 180 bottom
U5  31.7,16 270 bottom
U6  23.62,27.54 180 top
U7  18.46,27.64 180 top
U8  13.6,27.64 180 top
U9  8.14,27.74 180 top
U10  2.99,27.74 180 top
U11  28.46,28.14 180 top
U12  23.1,16 90 bottom
U13  3.8,7.8 0 bottom

### Tracks (layer width: path | path; a pad name or v marks a point on that pad's centre or on a via)
1N
  Top 0.25: J1.14 9.3,31.26 9.3,30.33 8.57,29.6 7.6,29.6 7.18,29.19 U9.4
  Top 0.254: RN5.1 4.05,25.65 5.4,27 5.4,28 5.79,28.39 U9.4
1P
  Top 0.25: J1.15 8.85,31.31 8.85,30.41 8.44,30 5.5,30 4.89,29.39 4.89,27.39 4.65,27.15 4.59,27.09 | 4.59,27.09 4.5,27 | U10.1 4.59,27.09
  Top 0.254: U10.1 3.25,26.4 RN5.2
2N  (via drill 0.25)
  Top 0.25: J1.12 v10.4,30.2 | RN4.3 v8.1,26.7 8.1,27.26 8.58,27.74 U9.2
  Bottom 0.25: v10.4,30.2 10.4,28.4 8.7,26.7 v8.1,26.7
2P
  Top 0.25: J1.13 9.9,30.39 8.73,29.22 8.22,29.22 8.14,29.14 8.14,28.19 7.69,27.74 U9.5 6.24,27.74 5.9,27.4 5.9,26.2 6.4,25.7 RN4.4
3N
  Top 0.25: RN4.1 10.1,25.7 10.3,25.9 10.3,26.75 11.84,28.29 12.5,28.29 | 12.5,28.29 U8.4 | J1.10 11.4,29.39 12.5,28.29
3P
  Top 0.25: RN4.2 8.9,26.3 9.09,26.48 U9.1 9.89,27.09 10.9,28.1 J1.11
4N  (via drill 0.25)
  Top 0.25: RN3.3 13.35,26.14 13.6,26.39 13.6,27.3 13.94,27.64 U8.2 15.31,27.64 v15.35,27.6 | v12.4,30.6 J1.8
  Bottom 0.25: v15.35,27.6 12.4,30.55 v12.4,30.6
4P
  Top 0.25: J1.9 11.9,30.2 13.5,28.59 13.5,27.89 13.25,27.64 U8.5 12.05,27.64 11.45,27.04 11.45,26.4 12.15,25.7 RN3.4
5N
  Top 0.25: J1.6 13.4,30.2 14.3,29.3 14.8,29.3 15.81,28.29 16.1,28.29 | U7.4 16.1,28.29 | RN3.1 15.5,25.7 15.8,26 15.8,28 15.81,28 16.1,28.29
5P  (via drill 0.25)
  Top 0.25: RN3.2 14.15,25.93 14.55,26.33 U8.1 v15.35,27 | v12.94,30.64 12.9,30.69 J1.7
  Bottom 0.25: v15.35,27 15.2,27.15 15.16,27.15 11.9,30.41 11.9,31.1 12.9,31.1 12.94,31.06 v12.94,30.64
6N
  Top 0.25: U7.2 18.54,27.64 | 18.54,27.64 18.4,27.5 18.4,26.7 18.57,26.53 19.25,26.53 19.7,26.08 RN2.3 | J1.4 14.4,30.4 15.8,29 18.2,29 18.54,28.66 18.54,27.64
6P  (via drill 0.25)
  Top 0.25: 16.86,27.6 16.45,27.19 16.45,26.49 16.79,26.15 18.15,26.15 18.6,25.7 RN2.4 | U7.5 16.9,27.64 16.86,27.6 | J1.5 v13.9,30.5 | v16.25,27.6 16.86,27.6
  Bottom 0.25: v13.9,30.5 13.9,30.4 16.25,28.05 v16.25,27.6
7N
  Top 0.25: J3.9 25.25,32.15 25.1,32.3 23.5,32.3 22.6,31.4 22.6,29.4 22.22,29.02 21.81,29.02 21.3,28.51 21.3,27.9 | 21.3,27.9 RN2.1 | U6.4 21.59,28.19 21.3,27.9
7P
  Top 0.25: U7.1 20.31,26.99 20.5,26.8 RN2.2
8N
  Top 0.25: U6.2 24.06,27.54 | RN1.3 27.65,26.63 27.34,26.94 26.47,26.94 25.87,27.54 U6.2 | J3.3 28.25,30.94 27.71,30.4 26.8,30.4 25.93,29.53 25.93,27.54 U6.2
8P
  Top 0.25: RN1.4 23.9,25.7 23.62,25.98 23.62,27.19 23.27,27.54 U6.5
_SRB1  (via drill 0.25)
  Top 0.254: RN5.7 v2.45,23.4 2.45,21.05 5.1,18.4 5.1,14.81 U1.17
  Bottom 0.25: CN6.6 2.42,23.37 v2.45,23.4
_SRB2  (via drill 0.25)
  Top 0.254: RN5.8 v1.65,23.4 1.65,20.86 4.6,17.91 4.6,13.4 8.7,9.3 9.46,9.3 U1.18
  Bottom 0.25: CN6.5 1.62,23.37 v1.65,23.4
ADS_CLK
  Top 0.305: U1.37 20.23,5.32 20.23,3.97 22.1,2.1 23.71,2.1 29.46,7.85 J2.3
ADS_RESET
  Top 0.305: U1.36 19.8,5.05 19.8,3.79 21.92,1.67 23.97,1.67 29.65,7.35 J2.2
AGND  (via drill 0.25)
  Top 0.25: U1.60 18.4,16.12 v18.4,16.1 | U1.31 17.5,8.15 v17.5,8.4 | J2.17 J2.18 27.63,15.35 26.36,16.62 C14.1 C13.1 26.36,18.66 v26.4,18.7 | v29.2,23.5 29.2,23.95 RN1.5 RN1.1 | J3.4 27.75,30.97 27.58,30.81 24.92,30.81 24.75,30.97 J3.10 24.75,29.17 24.57,28.99 U6.3 24.57,28.73 24.5,28.8 v24,28.8 | U7.3 v19.41,28.8 v19.4,28.8 | v9.1,28.9 9.1,28.41 U9.3 | v4,28.9 4,28.45 U10.3 | v14.6,28.8 14.6,28.34 U8.3 | U11.3 30.21,28.79 30.8,28.2 30.8,27.9 30.39,27.49 U11.1 | J1.18 J1.17 J1.16 v8.4,30.6
  Top 0.406: R1.1 22.9,3 v22.9,2.7 | RN1.1 29.25,27.49 U11.1
  Bottom 0.25: v18.4,16.1 18.4,9.3 v17.5,8.4 | CN2.1 CN2.8 29.17,23.47 v29.2,23.5
  Bottom 0.406: v17.5,8.4 17.56,8.4 19.31,10.15 22.34,10.15 22.83,9.66 22.83,5.53 22.37,5.07 19.31,5.07 18.76,4.52 18.76,2.88 19.33,2.31 22.51,2.31 v22.9,2.7 | CN5.1 CN5.2 CN5.3 CN5.4 5.82,20.92 v5.8,20.9 4.04,20.9 CN6.1 CN6.2 CN6.3 CN6.4 | CN4.4 CN4.3 CN4.2 CN4.1 CN3.4 CN3.3 CN3.2 CN3.1 22.61,22.2 v24.2,22.2 25.5,22.2 CN2.4 CN2.3 CN2.2 CN2.1
  pour Route2 (isolate 0.305, rank 2): 0.5,35.7 1.5,36.7 33.9,36.7 35.8,34.8 35.8,13.2 1.5,13.2 0.5,14.2
AVDD  (via drill 0.25)
  Top 0.25: C6.2 20.74,17.75 U1.59 | C5.2 23.1,18.74 v23.1,19.2 | J3.6 J3.5 27.25,32.15 v27.3,32.2 | J3.12 J3.11 24.25,30.75 v24.2,30.7
  Top 0.254: U11.2 30.16,28.14 30.22,28.08 v30.28,28.08 | U1.56 19.9,14.79 19.9,14.5 v20.2,14.2 | v23.1,19.2 23.16,19.25 | 27,19.25 27.01,19.24
  Top 0.305: U1.21 U1.22 12.6,9.61 12.6,10.9 12.4,11.1 v11.7,11.1 11,10.4 11,10.13 U1.19 | C4.2 3.43,12.1 v3.9,12.1 | C3.2 1.83,11.97 v1.8,12 | J2.22 J2.21 29.75,16.85 28.8,17.8 28.8,18.4 27.96,19.24 27.01,19.24 | U1.54 20.73,14.2 v20.2,14.2 | C6.2 21.31,17.77 C5.2 | C7.2 13.55,2.45 | 13.55,2.45 C8.2 | 13.55,2.45 13.25,2.45 12.6,1.8 12.7,1.7 v12.8,1.7 | 27,19.25 23.16,19.25
  Route15 0.305: 7.4,13.32 7.2,13.32 7.12,13.4 3.1,13.4
  Route15 0.61: v12.8,1.7 6.8,1.7 5.72,0.62 2.58,0.62 1.1,2.1 1.1,11.4 3.1,13.4
  pour Route15: 1.67,32.6 27.4,32.6 27.4,20.8 19.7,13.1 17.7,13.1 16.5,14.3 15.3,14.3 11.95,10.95 2.6,11 1.67,11.93
  pour Route15 (isolate 0.254): 27.1,29.48 30.4,29.48 30.4,26.6 27.1,26.6
AVSS  (via drill 0.25)
  Top 0.25: U1.53 22.33,15.1 23.4,15.1 24.2,15.9 | C5.1 21.43,17.02 U1.57 U1.58 | C6.1 22,19.02 22,19 | U1.23 v12.8,9.1 13.2,8.7 13.2,8.09 U1.25 | U1.20 11.28,9.7 11.8,9.7 v12,9.9 | v5.2,2.1 7,2.1 8.1,3.21 | J3.8 J3.7 26.25,32.15 v26.3,32.2 | J3.1 J3.2 28.75,32.05 28.7,32.1 v28.7,32.2
  Top 0.254: J2.20 31.75,16.35 31.8,16.4 | C20.2 12.6,3.38 14.05,3.38 C7.1 | U1.58 v19.1,15.4
  Top 0.305: C7.1 | C7.1 14.02,3.42 14.5,3.9 14.5,4.44 U1.32 | C7.1 C8.1 | C3.1 2.5,10.92 v2.5,10.3 | C4.1 v3.3,10.3 | J2.20 J2.19 | U10.4 v1.11,28.39 v1.1,28.4 | v19.1,15.4 19.1,14 19.5,13.6 20.83,13.6 U1.53
  Top 0.406: 22,19 22.8,19.8 v27.3,19.8 | C12.1 23.69,17.9 24.2,17.9 24.65,17.45 | 24.65,17.45 25.3,16.8 v25.3,16.1 25.1,15.9 24.2,15.9 | C11.1 24.58,17.45 24.65,17.45 | C14.2 27.38,17 v28,17 | C13.2 v28.1,18.1 | v5.2,2.1 9.13,2.1 C22.2 10.48,2.3 11.32,2.3 C20.2 | C21.2 8.1,3.21 8.1,4.63 | C23.2 8.1,4.63 | C15.1 8.1,6.1 8.1,4.63
  Top 0.508: 31.8,16.4 34.3,18.9 34.3,21.8 v33.4,22.7
  Route15 0.61: v1.1,28.4 1.1,23.75 1.02,23.66 1.02,23.14 1.1,23.05 v1.1,13
  Bottom 0.61: v1.1,13 1.17,12.93 1.17,11.74 2.5,10.41 v2.5,10.3
  Bottom 0.813: v26.3,32.2 26.3,32.4 27.6,33.7 28.7,33.7 v28.7,32.2
  pour Route15 (isolate 0.305, rank 3): 0.7,10.5 12.5,10.5 15.4,13.4 16.4,13.4 17.4,12.4 19.6,12.4 28.1,20.9 28.1,32.6 34.2,32.6 35.9,30.9 35.9,24.6 12.1,0.8 2.6,0.8 0.7,2.7
BIAS
  Top 0.25: J1.3 15,31.45 15,31.86 15.24,32.1 16.2,32.1 17.8,30.5 21.5,30.5 21.92,30.92 21.92,31.66 23.04,32.78 29.22,32.78 30.4,31.6 30.4,30.1 29.6,29.3 27.5,29.3 U11.4 28.31,28.79 28.45,28.66 RN1.2
BIAS_DRV  (via drill 0.25)
  Top 0.25: 19.6,20.11 R2.2 20.22,19.52 C9.2 21.43,20.7 26.3,20.7 28.45,22.85 v28.45,23.5 RN1.6
  Bottom 0.25: v28.45,23.5 28.37,23.42 CN2.7
BIAS_INV
  Top 0.25: U1.61 21.88,20.3 26.9,20.3 30.4,23.8 30.4,25.5 32.1,27.2 32.4,27.2
DVDD  (via drill 0.25)
  Top 0.25: J2.15 J2.16 29.75,14.35 v29.7,14.3 | U1.52 22.64,14.7 23.2,14.7 23.4,14.5 23.4,13.97 22.82,13.39 U1.50 | U1.35 17.73,6.4 17.5,6.4 16.2,5.1 16.2,2.6 14.55,0.95 4.85,0.95 v4.5,1.3
  Top 0.305: U1.48 23.57,10.7 23.96,10.7 24.6,10.06 | U1.35 19.2,4.93 | 19.2,4.9 19.2,4.93 | 19.2,4.93 19.3,4.83 v19.3,3.5 v19.29,3.5
  Top 0.406: C2.2 25.2,10.78 v25.2,10.8 | C1.2 24.6,10.06 v24.6,10.1 | v26,13.7 25.2,14.5 23.4,14.5
  Bottom 0.25: U5.5 30.12,14.3 v29.7,14.3 | v4.5,1.3 C41.2
  Bottom 0.305: U13.3 3.42,3.92 3.4,3.9 C49.2 3.4,2.9 3.75,2.55 C41.2
  pour Route15: 13.3,1.6 34.75,23.05 36.1,21.7 36.1,1.6 35.2,0.7 35.1,0.7 14.2,0.7
DVDD_ISO  (via drill 0.25)
  Top 0.406: v13.7,9.2 v13.7,11.7
  Bottom 0.25: DVDD_ISO.X 24.08,17.1 U12.5 | R8.1 13.76,12.6 C24.1 12.91,13.41 12.91,14.53 12.41,15.04 U2.8 12.41,19.57 12.2,19.77 10.77,19.77 10.37,19.37 10.37,17.47 10.22,17.32 9.38,17.32 9.3,17.4 9.3,19.16 8.95,19.5 8.24,19.5 7.73,19 C64.2 | U4.2 18.11,6.33 16.29,8.15 13.55,8.15 13.5,8.2 13.4,8.3 13.4,7.92 U3.8
  Bottom 0.305: L1.2 4.05,18.4 C64.2
  Bottom 0.406: R8.1 14.92,12.33 14.92,12.16 15.72,11.37 16.33,11.37 17.49,12.53 17.49,16.59 18,17.1 19.73,17.1 22.56,19.93 23.64,19.93 25.13,18.44 25.13,17.13 DVDD_ISO.X | v13.7,11.7 13.7,12.54 13.76,12.6 | v13.7,9.2 13.5,9 13.5,8.2
  pour Bottom (isolate 0.406): 29.3,20.1 29.3,5 25.4,1.1 11.3,1.1 3.1,9.3 3.1,19.3 5.3,21.5 27.9,21.5
EDA+  (via drill 0.25)
  Top 0.25: v15.9,30.4 J1.1
  Bottom 0.25: 10.35,20.15 9.8,19.6 9.8,18.48 U2.6 | 10.35,20.15 13.45,20.15 R9.2 | 10.35,20.15 11.4,21.2 11.4,24.7 13,26.3 16.2,26.3 17,27.1 17,28.5 15.9,29.6 v15.9,30.4
EDA-  (via drill 0.25)
  Top 0.25: J1.2 15.4,30.43 v15.37,30.4 | v10.14,16.75 9.8,17.1 9.8,21.4 v10.7,22.3
  Bottom 0.25: R10.1 11.64,11.92 11.64,14.53 11.14,15.04 U2.7 11.14,16.7 11.08,16.65 10.25,16.65 v10.14,16.75 | v10.7,22.3 10.7,27.9 11.52,28.72 11.52,31.26 11.74,31.48 13.56,31.48 14.64,30.4 v15.37,30.4
GND  (via drill 0.25)
  Top 0.25: 22.45,13.75 U1.51 22.35,13.75 21.59,12.99 v21.59,12.41 22.47,12.41 U1.49 | U1.33 18.3,4.42 18.3,3.3 v18.2,3.2 | v6.4,32.6 J1.20
  Top 0.254: 31,12.35 J2.12 J2.11 J2.10
  Top 0.305: J1.20 J1.19
  Top 0.406: R3.1 v25.49,6.8 v25.5,6.8 | R5.1 24.27,5.6 v24.3,5.6 | R4.1 24.9,6.24 v24.9,6.2 | v32.2,12.4 32.15,12.35 31,12.35 | v23.4,4.8 23.4,4.83 R6.1 | v26.9,9.1 26.88,9.1 C2.1 | v26.3,8.4 26.26,8.4 C1.1
  Bottom 0.25: 6.3,32.7 v6.4,32.6 | 32.4,17.07 U5.3 | 32.2,17.07 U5.2 31.7,14.52 29.77,12.59 29.77,8.69 30.9,7.57 33.15,7.57 35.1,9.52 GND.X 32.43,11.1 U4.5
  Bottom 0.254: 32.2,17.07 32.4,17.07
  Bottom 0.305: 4.5,4.75 U13.2 4.69,4.7 | U13.4 2.15,3.55 C49.1 2.4,2.9 2.05,2.55 C41.1 2.05,2.15 v2.07,2.17 | 4.69,4.7 4.69,3.51 v4.9,3.3 | U13.1 4.93,4.94 4.69,4.7
  Bottom 0.406: v32.2,12.4 32.2,11.49 U4.5
  Bottom 0.813: U4.5 33.91,11.41 36.1,13.6 36.1,32.7 31.4,37.4 6.1,37.4 5.7,37 5.7,33.3 6.3,32.7
  pour Route2 (isolate 0.406, rank 2): 1,12.5 0.5,12 0.5,1.7 1.5,0.7 35.1,0.7 36.1,1.7 36.1,12 35.6,12.5
  pour Top: 20.3,12.6 20.4,12.7 31.7,12.7 35.4,12.7 36,12.1 36,1.8 35,0.8 18.2,0.8 17.7,1.3 17.7,10
GND_ISO  (via drill 0.25)
  Bottom 0.25: v10.1,4.4 8.7,4.4 8.23,3.93 C31.2 9.53,3.43 9.67,3.29 9.67,3.01 U3.4
  Bottom 0.406: U12.2 U12.3 22.15,14.35 v20.9,13.1 20.9,11.44 U4.4 | C26.2 16.5,12.4 v16,11.9 15.55,12.35 R7.2 | v16.8,2.9 R13.2 | U2.4 8.38,13.8 v7.4,13.8 | v7.4,13.8 7.4,12.87 9.45,10.82 C28.2 | v7.4,13.8 7.36,13.84 U13.8 5.96,13.9 4.75,13.9 U13.7 4.63,13.78 4.63,12.08 4.12,11.57 3.28,11.57 2.73,12.12 2.73,13.26 U13.5 1.25,14.74 1.25,15.5 | 14.25,18.2 C27.2 15.44,18.3 C25.2 | C25.2 14.95,18.89 R9.1 15,19.6 GND_ISO.X | C64.1 1.45,19 1.25,18.8 1.25,17.6 | 1.25,17.6 1.25,16.6 | 1.25,16.6 1.25,15.5 | L2.1 1.3,17.65 1.25,17.6 | L2.2 1.3,16.55 1.25,16.6 | C51.1 1.25,15.5 | C25.2 16.25,18.35 v16.3,18.3
  pour Route2 (isolate 0.305): 16.6,19.2 16.6,14.17 21.3,14.17 21.3,12.6 16.6,12.6 16.6,6.9 17.7,5.8 17.7,3.5 17,2.8 7.7,2.8 6.8,3.7 6.8,12 5.4,13.4 2.7,13.4 1.4,14.7 1.4,16.4 4.2,19.2
IN1N  (via drill 0.25)
  Top 0.254: RN5.5 v4.05,23.4 4.05,21.4 6.5,18.95 6.5,16.93 U1.15
  Bottom 0.25: CN6.8 4.02,23.4 v4.05,23.4
IN1P  (via drill 0.25)
  Top 0.254: RN5.6 v3.25,23.4 3.25,21.22 6,18.47 6,16.7 9.66,13.04 U1.16
  Bottom 0.25: CN6.7 3.22,23.37 v3.25,23.4
IN2N  (via drill 0.25)
  Top 0.254: U1.13 8.2,16.64 8.2,22.7 8.1,22.8 v8.1,23.4 RN4.7
  Bottom 0.25: v8.1,23.4 v8.09,23.39 CN5.6
IN2P  (via drill 0.25)
  Top 0.254: U1.14 7.7,16.44 7.7,22 7.3,22.4 v7.3,23.4 RN4.8
  Bottom 0.25: v7.3,23.4 v7.29,23.39 CN5.5
IN3N  (via drill 0.25)
  Top 0.254: U1.11 9.2,17.06 9.2,22 9.7,22.5 v9.7,23.4 RN4.5
  Bottom 0.25: v9.7,23.4 v9.69,23.39 CN5.8
IN3P  (via drill 0.25)
  Top 0.254: U1.12 8.7,16.85 8.7,22.6 8.9,22.8 v8.9,23.4 RN4.6
  Bottom 0.25: v8.9,23.4 v8.89,23.39 CN5.7
IN4N  (via drill 0.25)
  Top 0.254: RN3.7 v13.35,23.3 13.35,22.59 11.12,20.36 11.12,16.55 U1.9
  Bottom 0.25: CN4.6 13.35,22.63 v13.35,23.3
IN4P  (via drill 0.25)
  Top 0.254: U1.10 10.6,16.36 10.6,20.61 12.55,22.56 v12.55,23.3 RN3.8
  Bottom 0.25: CN4.5 v12.56,23.29 v12.55,23.3
IN5N  (via drill 0.25)
  Top 0.254: RN3.5 v14.95,23.3 14.95,22.95 11.9,19.9 11.9,17.19 U1.7
  Bottom 0.25: 15,22.66 CN4.8 v14.96,23.29 v14.95,23.3
IN5P  (via drill 0.25)
  Top 0.254: U1.8 11.5,16.88 11.5,20.2 14.15,22.85 v14.15,23.3 RN3.6
  Bottom 0.25: 14.25,22.71 CN4.7 v14.16,23.29 v14.15,23.3
IN6N  (via drill 0.25)
  Top 0.254: RN2.7 v19.7,23.5 19.7,23.34 19.2,22.84 16.04,22.84 12.86,19.66 12.86,17.64 U1.5
  Bottom 0.25: CN3.6 19.7,22.66 v19.7,23.5
IN6P  (via drill 0.25)
  Top 0.254: RN2.8 v18.9,23.5 18.62,23.22 15.8,23.22 12.38,19.8 12.38,17.41 U1.6
  Bottom 0.25: CN3.5 18.93,23.47 v18.9,23.5
IN7N  (via drill 0.25)
  Top 0.254: RN2.5 v21.3,23.5 21.3,23.18 20,21.88 16.34,21.88 13.62,19.16 13.62,18.29 U1.3
  Bottom 0.25: CN3.8 21.3,22.66 v21.3,23.5
IN7P  (via drill 0.25)
  Top 0.254: RN2.6 v20.5,23.5 20.5,23.36 19.5,22.36 16.2,22.36 13.24,19.4 13.24,17.97 U1.4
  Bottom 0.25: CN3.7 20.5,22.66 v20.5,23.5
IN8N  (via drill 0.25)
  Top 0.254: U1.1 17.74,21.1 25.7,21.1 27.65,23.05 v27.65,23.5 RN1.7
  Bottom 0.25: v27.65,23.5 27.57,23.42 CN2.6
IN8P  (via drill 0.25)
  Top 0.254: RN1.8 v26.85,23.5 26.85,23.4 24.94,21.49 16.59,21.49 14,18.9 14,18.62 U1.2
  Bottom 0.25: v26.85,23.5 26.77,23.42 CN2.5
N$1
  Bottom 0.25: R11.1 R10.2 10.47,8.77 10.46,8.76 10.46,6.87 10.91,6.42 13.67,6.42 14.8,7.55 15.7,7.55 16.05,7.21 C30.1
N$2  (via drill 0.25)
  Top 0.25: v9.62,12.22 9.62,12.16 12.66,12.16 v14.7,14.2
  Bottom 0.25: C26.1 R7.1 | R8.2 14.65,14.15 v14.7,14.2 | v9.62,12.22 9.8,12.4 9.8,13.52 U2.3
  Bottom 0.406: R8.2 R7.1
N$3
  Bottom 0.25: U3.3 10.96,1.57 10,0.6 7.4,0.6 6.7,1.3 6.7,3.9
  Bottom 0.254: 6.7,3.9 8.45,5.65 R11.2 C28.1
N$4
  Bottom 0.25: C31.1 8.23,1.33 8.46,1.1 9,1.1 9.55,1.1 10.3,1.84 10.3,3.9 10.6,4.2 11.4,4.2 12.2,4.2
  Bottom 0.254: RAW_EDA_SIG.X 9,1.1
  Bottom 0.305: C31.1 R15.1 | R14.2 14.8,6.8 12.2,4.2
N$5
  Bottom 0.25: R16.1 24.28,14.7 U12.1 24.05,15.58 23.14,16.48 23.14,17.36 23.6,17.81 C10.2
N$6
  Bottom 0.305: U13.6 3.5,13.92 3.5,15.4 C51.2 3.4,16.45 L1.1
N$7
  Bottom 0.254: R16.2 26.9,14.7 27.3,14.3
  Bottom 0.406: 27.3,14.3 27.8,13.8 27.8,5.2 26.39,3.79 U4.1
N$9
  Bottom 0.25: C16.1 32.8,18.5 R17.1 32.7,18.21 33.36,17.55 33.36,15.24 33.05,14.93 U5.4 32.65,14.23 30.35,11.93 30.35,9.56 31.03,8.87 U4.6
N$10
  Bottom 0.254: C29.1 R12.1 R13.1 15,1.7 14.4,1.1 12.7,1.1 12.23,1.57 U3.2
N$11
  Bottom 0.254: U3.1 13.5,4.91 14.4,5.8 R14.1 | C30.2 16.05,4.85 C29.2 R12.2
  Bottom 0.305: R14.1 C30.2
N$12  (via drill 0.25)
  Top 0.25: v10.7,11.71 10.78,11.78 12.92,11.78 15.15,14.01 15.15,14.39 14.89,14.65 14.15,14.65 v14.1,14.7
  Bottom 0.25: C25.1 14.74,16.6 C27.1 14.05,16.5 | U2.5 8.59,16.61 11.1,14.1 | U2.2 11.14,12.14 v10.71,11.71 v10.7,11.71
  Bottom 0.254: U2.2 11.1,13.62 11.1,14.1
  Bottom 0.406: C27.1 14.15,14.75 v14.1,14.7 13.74,14.34 C24.2
N$14
  Bottom 0.254: R15.2 7.37,3.87 9.7,6.19 U3.5
N$15
  Bottom 0.25: C10.1 22.15,17.95 U12.4 21.65,17.07 21.14,16.55 18.21,16.55 17.95,16.29 17.95,9.9 17.95,9.56
  Bottom 0.254: U3.7 12.23,7.9 | 12.23,7.9 12.23,9.18 12.76,9.7 15.3,9.7 | 15.3,9.7 15.4,9.7 | U4.3 19.28,8.87 18.15,7.75 17.25,7.75 15.45,9.55 | U3.6 11.05,7.9 12.23,7.9 | 15.3,9.7 15.45,9.55 | 17.95,9.9 15.8,9.9 15.45,9.55
N$17
  Top 0.25: R2.1 18.89,18.73 U1.63 U1.62 19.51,18.64 C9.1
N$22
  Top 0.305: U1.24 11.6,7.2 10.67,7.2 C23.1 9.82,7.62 C15.2
N$24
  Top 0.305: U1.46 23.25,8.67 23.7,8.67 24.16,8.21 R3.2
N$48
  Top 0.305: U1.45 23.61,7.6 R4.2
N$50
  Top 0.305: U1.44 22.69,7.81 22.69,7.18 R5.2
N$52
  Top 0.25: U1.42 21.7,7.39 21.7,6.8
  Top 0.305: 21.7,6.8 21.7,6.53 R6.2
N$59
  Top 0.305: U1.26 12.32,6.5 12.22,6.5 12.21,6.49 11.98,6.49 11.97,6.5 11.39,6.5 C21.1
N$60
  Top 0.25: U1.28 12.93,5.7 12.8,5.7
  Top 0.406: 12.8,5.7 12.73,5.7 C22.1
N$61
  Top 0.25: U1.30 13.6,4.95 13.6,4.58 C20.1
N$63
  Top 0.25: U1.55 22.31,16.49 C12.2 22.43,16.52 C11.2
N$66
  Top 0.305: U1.38 20.41,5.85 20.41,5.75 20.66,5.5 20.66,5.23 R1.2
PA02_EDA_SIG  (via drill 0.25)
  Top 0.254: J2.23 29.55,17.85 v29.5,17.9
  Bottom 0.25: PA02_EDA_SIG.X C16.2 31.7,19.3 R17.2 30.75,17.45 U5.1 30.75,17.67 30.52,17.9 v29.5,17.9
PA07_DRDY
  Top 0.305: U1.47 23.52,9.1 24.4,9.1 25.58,7.92 26.82,7.92 28.75,9.85 J2.7
PA16_S1_MOSI
  Top 0.305: U1.34 18.81,4.62 18.81,3.17 20.84,1.14 24.29,1.14 30,6.85 J2.1
PA17_S1_SCK
  Top 0.305: U1.40 21.27,6.4 21.27,6.14 23.21,4.2 24.5,4.2 29.15,8.85 J2.5
PA19_S1_MISO
  Top 0.25: U1.43 22.29,7.51 22.29,6.8 24.14,4.94
  Top 0.305: J2.6 28.96,9.35 24.55,4.94 24.14,4.94
PA20_CS
  Top 0.305: U1.39 20.84,6.13 20.84,5.96 23.03,3.77 24.77,3.77 29.35,8.35 J2.4
S0_I2C_SCL
  Top 0.305: J2.9 32.75,10.85 35.9,14 35.9,32.6 31.3,37.2 5.7,37.2 4.9,36.4 J1.23
S0_I2C_SDA
  Top 0.305: J2.8 33.06,10.35 36.4,13.69 36.4,32.91 31.61,37.7 5.59,37.7 4.4,36.51 J1.24
SRB1
  Top 0.254: RN5.3 2.45,26.25 3,26.8 3,27.6 3.14,27.74 U10.2
SRB2
  Top 0.254: U10.5 2,27.7 1.1,27.7 0.8,27.4 0.8,26.1 1.3,25.6 RN5.4
VCC
  Top 0.25: J2.13 J2.14 31.25,13.35 31.3,13.4
  Top 0.305: 5.6,32.6 5.6,32.3 5.4,32.1 J1.22 J1.21
  Top 0.61: 31.25,13.35 33.35,13.35 35,15 35,32.5 31,36.5 7.5,36.5 5.6,34.6 5.6,32.6

### Text on the board
Dimension: When designing flex connector to board pay / attention the flip that the board has to make / in order to keep the WIFI module facing outward
bNames: FACIA_MAINBOARD_V0_11/21/19 | DVDD_ISO | PA02_EDA_SIG | GND_ISO | GND | RAW_EDA_SIG